# EAGLE design Jumper Board V3.0 (EAGLE 9.6.2)
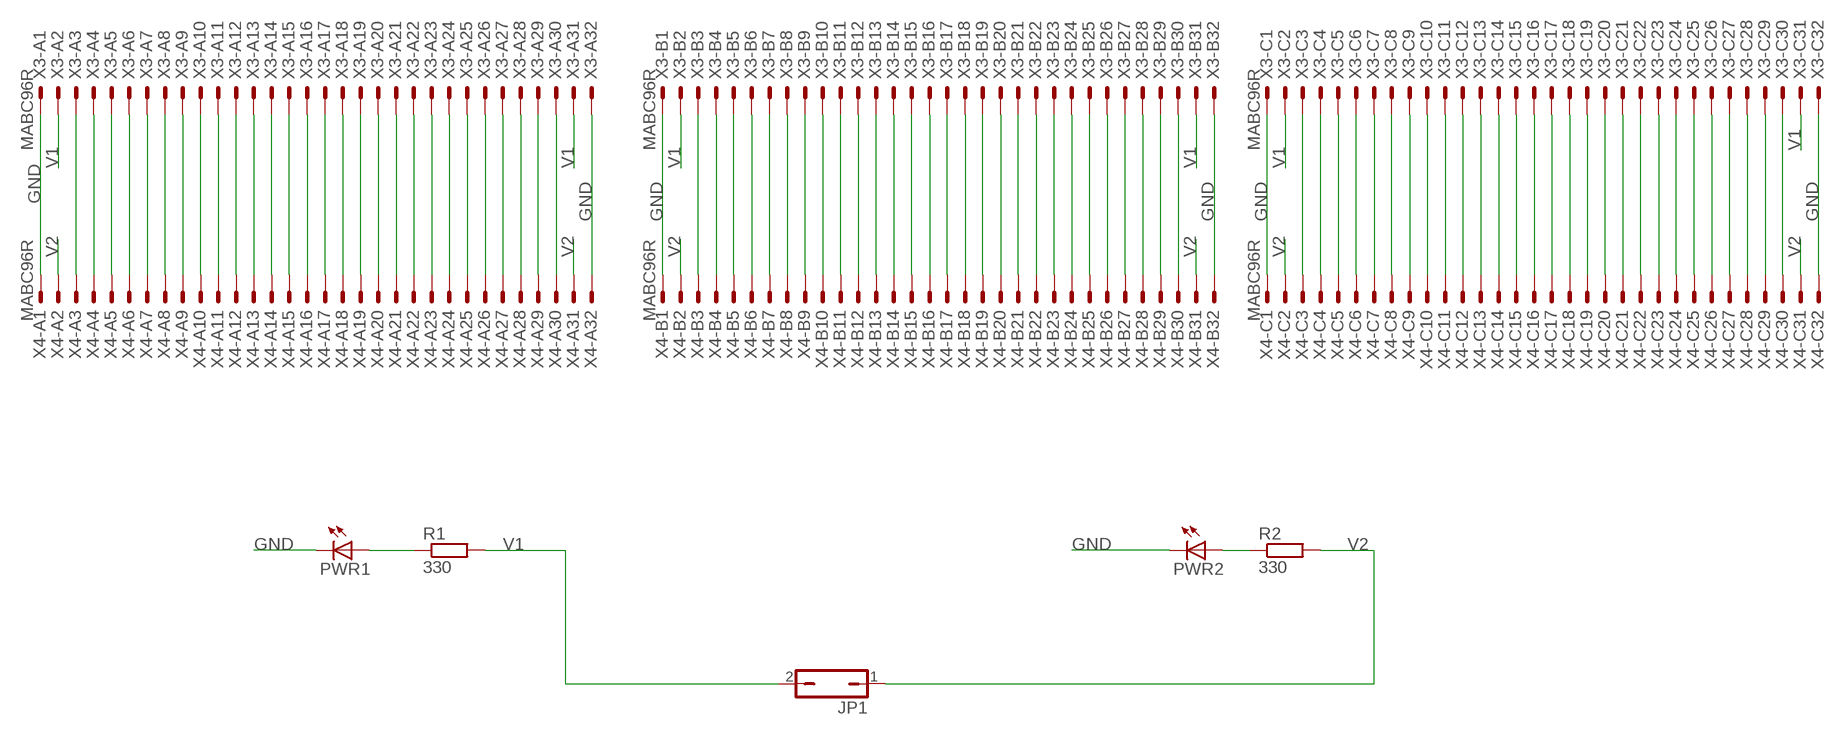
[diagram p0: schematic, sheet 1]

## Parts
JP1  JP1Q  [JP1]
PWR1  LED5MM  [LED5MM]
PWR2  LED5MM  [LED5MM]
R1  330  R0207/10  [0207/10]
R2  330  R0207/10  [0207/10]
X3  MABC96R  [MABC96R]
X4  MABC96R  [MABC96R]

## Nets
GND [GND]: PWR1.K(C) PWR2.K(C) X3.A1 X3.A32 X3.B1 X3.B32 X3.C1 X3.C32 X4.A1 X4.A32 X4.B1 X4.B32 X4.C1 X4.C32
N$4: X3.A3 X4.A3
N$6: X3.A4 X4.A4
N$7: X3.A5 X4.A5
N$8: X3.A6 X4.A6
N$9: X3.A7 X4.A7
N$10: X3.A8 X4.A8
N$11: X3.A9 X4.A9
N$12: X3.A10 X4.A10
N$13: X3.A11 X4.A11
N$14: X3.A12 X4.A12
N$15: X3.A13 X4.A13
N$16: X3.A14 X4.A14
N$17: X3.A15 X4.A15
N$18: X3.A16 X4.A16
N$19: X3.A17 X4.A17
N$20: X3.A18 X4.A18
N$21: X3.A19 X4.A19
N$22: X3.A20 X4.A20
N$23: X3.A21 X4.A21
N$24: X3.A22 X4.A22
N$25: X3.A23 X4.A23
N$26: X3.A24 X4.A24
N$27: X3.A25 X4.A25
N$28: X3.A26 X4.A26
N$29: X3.A27 X4.A27
N$30: X3.A28 X4.A28
N$31: X3.A29 X4.A29
N$32: X3.A30 X4.A30
N$35: PWR1.A R1.1
N$36: PWR2.A R2.1
N$37: X3.B3 X4.B3
N$38: X3.B4 X4.B4
N$39: X3.B5 X4.B5
N$40: X3.B6 X4.B6
N$41: X3.B7 X4.B7
N$42: X3.B8 X4.B8
N$43: X3.B9 X4.B9
N$44: X3.B10 X4.B10
N$45: X3.B11 X4.B11
N$46: X3.B12 X4.B12
N$47: X3.B13 X4.B13
N$48: X3.B14 X4.B14
N$49: X3.B15 X4.B15
N$50: X3.B16 X4.B16
N$51: X3.B17 X4.B17
N$52: X3.B18 X4.B18
N$53: X3.B19 X4.B19
N$54: X3.B20 X4.B20
N$55: X3.B21 X4.B21
N$56: X3.B22 X4.B22
N$57: X3.B23 X4.B23
N$58: X3.B24 X4.B24
N$59: X3.B25 X4.B25
N$60: X3.B26 X4.B26
N$61: X3.B27 X4.B27
N$62: X3.B28 X4.B28
N$63: X3.B29 X4.B29
N$64: X3.B30 X4.B30
N$69: X3.C3 X4.C3
N$70: X3.C4 X4.C4
N$71: X3.C5 X4.C5
N$72: X3.C6 X4.C6
N$73: X3.C7 X4.C7
N$74: X3.C8 X4.C8
N$75: X3.C9 X4.C9
N$76: X3.C10 X4.C10
N$77: X3.C11 X4.C11
N$78: X3.C12 X4.C12
N$79: X3.C13 X4.C13
N$80: X3.C14 X4.C14
N$81: X3.C15 X4.C15
N$82: X3.C16 X4.C16
N$83: X3.C17 X4.C17
N$84: X3.C18 X4.C18
N$85: X3.C19 X4.C19
N$86: X3.C20 X4.C20
N$87: X3.C21 X4.C21
N$88: X3.C22 X4.C22
N$89: X3.C23 X4.C23
N$90: X3.C24 X4.C24
N$91: X3.C25 X4.C25
N$92: X3.C26 X4.C26
N$93: X3.C27 X4.C27
N$94: X3.C28 X4.C28
N$95: X3.C29 X4.C29
N$96: X3.C30 X4.C30
V1 [VCC1]: JP1.2 R1.2 X3.A2 X3.A31 X3.B2 X3.B31 X3.C2 X3.C31
V2 [VCC2]: JP1.1 R2.2 X4.A2 X4.A31 X4.B2 X4.B31 X4.C2 X4.C31

## Library data of the parts
JP1 = jumper:JP1Q: JUMPER
PWR1 PWR2 = led:LED: LED OSRAM: - CHIPLED LG R971, LG N971, LY N971, LG Q971, LY Q971, LO R971, LY R971 LH N974, LH R974 LS Q976, LO Q976, LY Q976 LO Q996 - Hyper CHIPLED LW Q18S LB Q993, LB Q99A, LB R99A - SideLED LS A670, LO A670, LY A670, LG A670, LP A670 LB A673, LV A673, LT A673, LW A673 LH A674 LY A675 LS A676, LA A676, LO A676, LY A676, LW A676 LS A679, LY A679, LG A679 - Hyper Micro SIDELED® LS Y876, LA Y876, LO Y876, LY Y876 LT Y87S - SmartLED LW L88C, LW L88S LB L89C, LB L89S, LG L890 LS L89K, LO L89K, LY L89K LS L896, LA L896, LO L896, LY L896 - TOPLED LS T670, LO T670, LY T670, LG T670, LP T670 LSG T670, LSP T670, LSY T670, LOP T670, LYG T670 LG T671, LOG T671, LSG T671 LB T673, LV T673, LT T673, LW T673 LH T674 LS T676, LA T676, LO T676, LY T676, LB T676, LH T676, LSB T676, LW T676 LB T67C, LV T67C, LT T67C, LS T67K, LO T67K, LY T67K, LW E67C LS E67B, LA E67B, LO E67B, LY E67B, LB E67C, LV E67C, LT E67C LW T67C LS T679, LY T679, LG T679 LS T770, LO T770, LY T770, LG T770, LP T770 LB T773, LV T773, LT T773, LW T773 LH T774 LS E675, LA E675, LY E675, LS T675 LS T776, LA T776, LO T776, LY T776, LB T776 LHGB T686 LT T68C, LB T68C - Hyper Mini TOPLED® LB M676 - Mini TOPLED Santana® LG M470 LS M47K, LO M47K, LY M47K Source: http://www.osram.convergy.de LUXEON: - LUMILED® LXK2-PW12-R00, LXK2-PW12-S00, LXK2-PW14-U00, LXK2-PW14-V00 LXK2-PM12-R00, LXK2-PM12-S00, LXK2-PM14-U00 LXK2-PE12-Q00, LXK2-PE12-R00, LXK2-PE12-S00, LXK2-PE14-T00, LXK2-PE14-U00 LXK2-PB12-K00, LXK2-PB12-L00, LXK2-PB12-M00, LXK2-PB14-N00, LXK2-PB14-P00, LXK2-PB14-Q00 LXK2-PR12-L00, LXK2-PR12-M00, LXK2-PR14-Q00, LXK2-PR14-R00 LXK2-PD12-Q00, LXK2-PD12-R00, LXK2-PD12-S00 LXK2-PH12-R00, LXK2-PH12-S00 LXK2-PL12-P00, LXK2-PL12-Q00, LXK2-PL12-R00 Source: www.luxeon.com KINGBRIGHT: KA-3528ASYC Source: www.kingbright.com
R1 R2 = eagle-ltspice:R: RESISTOR, European symbol; SPICEMODEL: NONE; SPICEPREFIX: R
X3 X4 = con-vg:MABC96R: CONNECTOR male, 96 pins, type R, rows ABC, grid 2.54 mm

## Net classes
1 GND: width 0.508 mm, clearance 0.508 mm
2 VCC1: width 0.508 mm, clearance 0.508 mm
3 VCC2: width 0.508 mm, clearance 0.508 mm

## Board
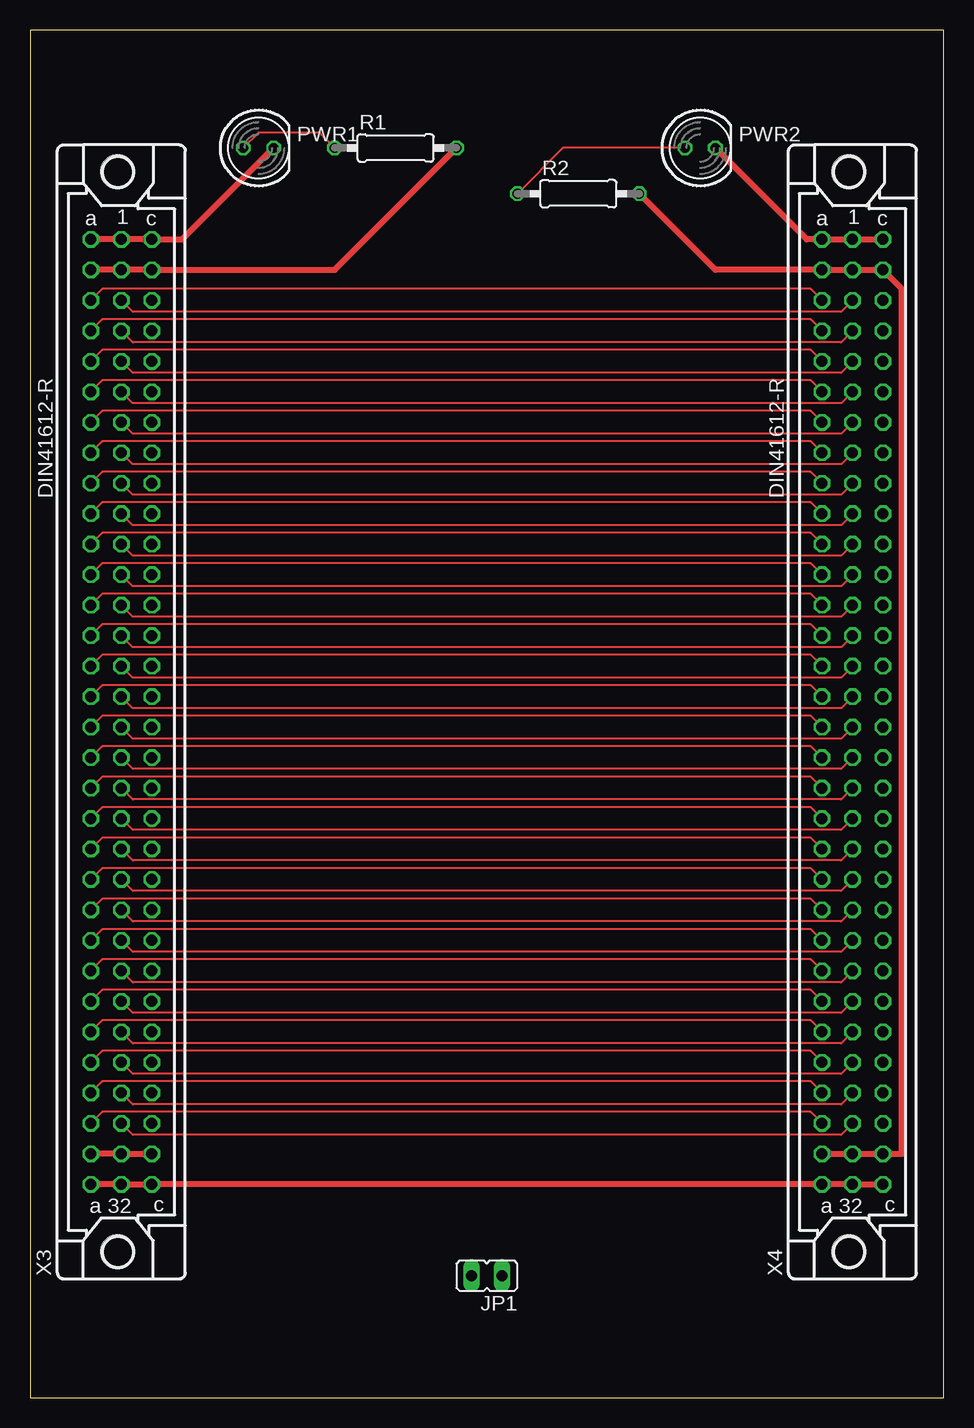
[diagram p1: board, top side]
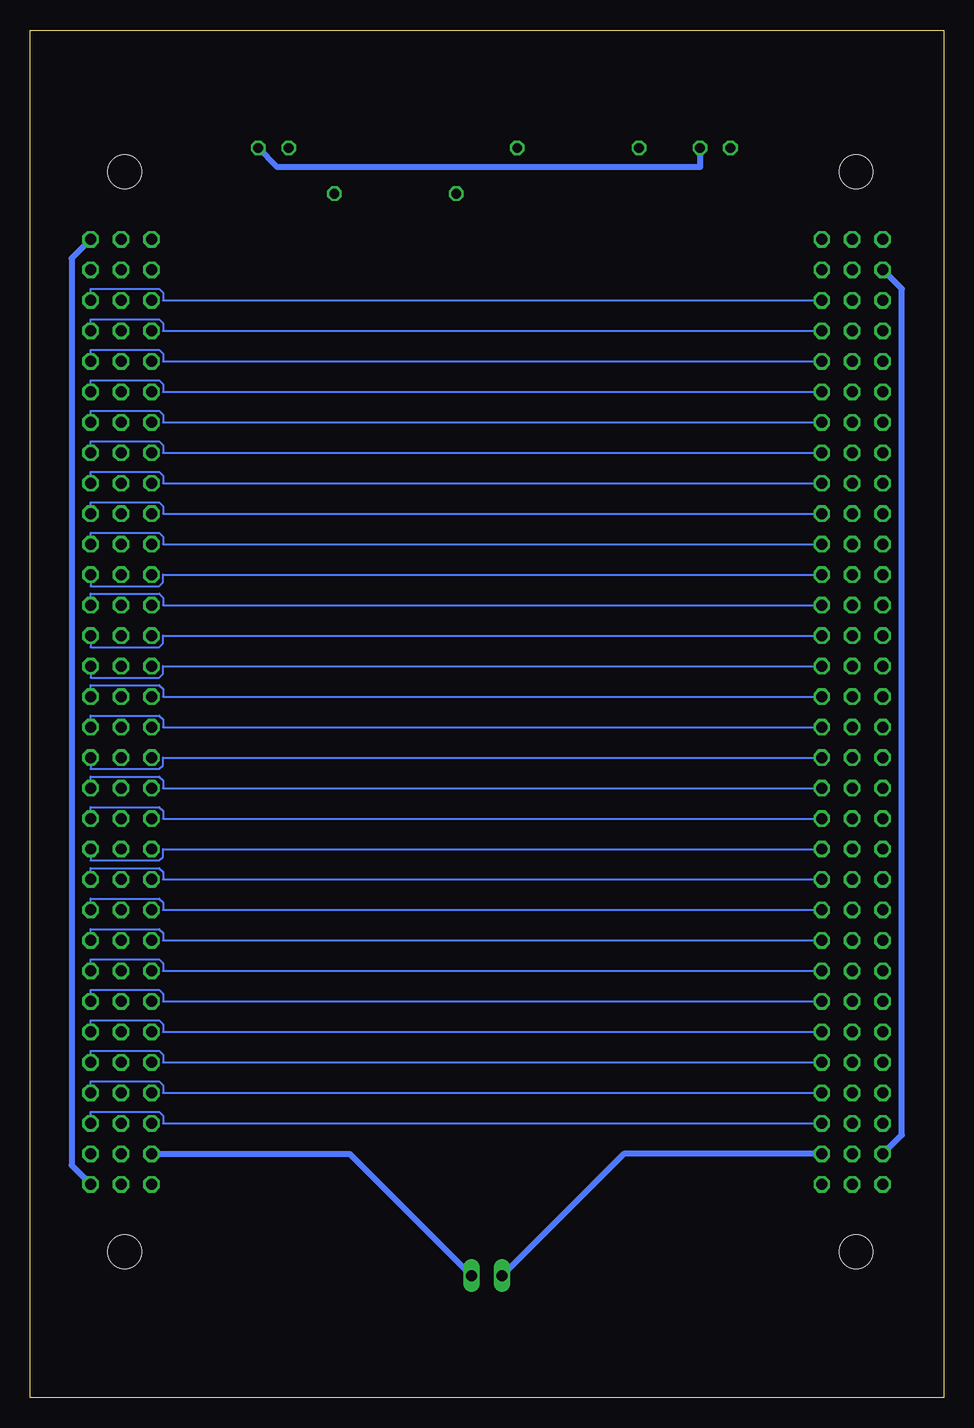
[diagram p2: board, bottom side, seen from below]

Size 76.18 x 113.97 mm. Coordinates in mm from the lower left corner, seen from the top.
Outline: 0,0 76.18,0 76.18,113.97 0,113.97 0,0
Copper layers (1*16): Top 0.0356mm / dielectric 1.5011mm / Bottom 0.0356mm
Design rules "LaenPCBOrder": minimum track width 6mil, minimum drill 13mil, track to track 6mil, track to pad 6mil, pad to pad 6mil, via to via 6mil, smd to smd 6mil, copper to edge 15mil, drill to drill 6mil, minimum pad ring 7mil, minimum via ring 7mil, stop-mask expansion 3mil, vias tented up to drill 0mil, thermal gap 10mil

### Footprints (pad centres in the part's own frame; a part is rotated, then mirrored left to right if it is on the bottom)
JP1 = drill 0.914 long: 1 0,-1.27; 2 0,1.27
LED5MM = drill 0.813 octagon: A -1.27,0; K 1.27,0
0207/10 = drill 0.813 octagon: 1 -5.08,0; 2 5.08,0
MABC96R = drill 0.914 octagon: A1 -2.54,39.37; A2 -2.54,36.83; A3 -2.54,34.29; A4 -2.54,31.75; A5 -2.54,29.21; A6 -2.54,26.67; A7 -2.54,24.13; A8 -2.54,21.59; A9 -2.54,19.05; A10 -2.54,16.51; A11 -2.54,13.97; A12 -2.54,11.43; A13 -2.54,8.89; A14 -2.54,6.35; A15 -2.54,3.81; A16 -2.54,1.27; A17 -2.54,-1.27; A18 -2.54,-3.81; A19 -2.54,-6.35; A20 -2.54,-8.89; A21 -2.54,-11.43; A22 -2.54,-13.97; A23 -2.54,-16.51; A24 -2.54,-19.05; A25 -2.54,-21.59; A26 -2.54,-24.13; A27 -2.54,-26.67; A28 -2.54,-29.21; A29 -2.54,-31.75; A30 -2.54,-34.29; A31 -2.54,-36.83; A32 -2.54,-39.37; B1 0,39.37; B2 0,36.83; B3 0,34.29; B4 0,31.75; B5 0,29.21; B6 0,26.67; B7 0,24.13; B8 0,21.59; B9 0,19.05; B10 0,16.51; B11 0,13.97; B12 0,11.43; B13 0,8.89; B14 0,6.35; B15 0,3.81; B16 0,1.27; B17 0,-1.27; B18 0,-3.81; B19 0,-6.35; B20 0,-8.89; B21 0,-11.43; B22 0,-13.97; B23 0,-16.51; B24 0,-19.05; B25 0,-21.59; B26 0,-24.13; B27 0,-26.67; B28 0,-29.21; B29 0,-31.75; B30 0,-34.29; B31 0,-36.83; B32 0,-39.37; C1 2.54,39.37; C2 2.54,36.83; C3 2.54,34.29; C4 2.54,31.75; C5 2.54,29.21; C6 2.54,26.67; C7 2.54,24.13; C8 2.54,21.59; C9 2.54,19.05; C10 2.54,16.51; C11 2.54,13.97; C12 2.54,11.43; C13 2.54,8.89; C14 2.54,6.35; C15 2.54,3.81; C16 2.54,1.27; C17 2.54,-1.27; C18 2.54,-3.81; C19 2.54,-6.35; C20 2.54,-8.89; C21 2.54,-11.43; C22 2.54,-13.97; C23 2.54,-16.51; C24 2.54,-19.05; C25 2.54,-21.59; C26 2.54,-24.13; C27 2.54,-26.67; C28 2.54,-29.21; C29 2.54,-31.75; C30 2.54,-34.29; C31 2.54,-36.83; C32 2.54,-39.37 | hole 2.794: -0.305,45; -0.305,-45

### Placement (x,y rotation side)
JP1  38.1,10.16 90 top
PWR1  19.05,104.14 0 top
PWR2  55.88,104.14 0 top
R1  30.48,104.14 0 top
R2  45.72,100.33 0 top
X3  7.62,57.15 0 top
X4  68.58,57.15 0 top

### Tracks (layer width: path | path; a pad name or v marks a point on that pad's centre or on a via)
GND
  Top 0.508: X3.A32 X3.B32 X3.C32 X4.A32 X4.B32 X4.C32 | PWR2.K 64.77,96.52 X4.A1 X4.B1 X4.C1 | X3.A1 X3.B1 X3.C1 12.7,96.52 PWR1.K
  Bottom 0.508: PWR2.K 55.56,102.55 20.32,102.55 PWR1.K | X4.C32 72.71,19.37 72.71,94.93 X4.C1
N$4
  Top 0.152: X3.A3 6.03,92.39 65.09,92.39 X4.A3
N$6
  Top 0.152: X3.A4 6.03,89.85 65.09,89.85 X4.A4
N$7
  Top 0.152: X3.A5 6.03,87.31 65.09,87.31 X4.A5
N$8
  Top 0.152: X3.A6 6.03,84.77 65.09,84.77 X4.A6
N$9
  Top 0.152: X3.A7 6.03,82.23 65.09,82.23 X4.A7
N$10
  Top 0.152: X3.A8 6.03,79.69 65.09,79.69 X4.A8
N$11
  Top 0.152: X3.A9 6.03,77.15 65.09,77.15 X4.A9
N$12
  Top 0.152: X3.A10 6.03,74.61 65.09,74.61 X4.A10
N$13
  Top 0.152: X3.A11 6.03,72.07 65.09,72.07 X4.A11
N$14
  Top 0.152: X3.A12 6.03,69.53 65.09,69.53 X4.A12
N$15
  Top 0.152: X3.A13 6.03,66.99 65.09,66.99 X4.A13
N$16
  Top 0.152: X3.A14 6.03,64.45 65.09,64.45 X4.A14
N$17
  Top 0.152: X3.A15 6.03,61.91 65.09,61.91 X4.A15
N$18
  Top 0.152: X3.A16 6.03,59.37 65.09,59.37 X4.A16
N$19
  Top 0.152: X3.A17 6.03,56.83 65.09,56.83 X4.A17
N$20
  Top 0.152: X3.A18 6.03,54.29 65.09,54.29 X4.A18
N$21
  Top 0.152: X3.A19 6.03,51.75 65.09,51.75 X4.A19
N$22
  Top 0.152: X3.A20 6.03,49.21 65.09,49.21 X4.A20
N$23
  Top 0.152: X3.A21 6.03,46.67 65.09,46.67 X4.A21
N$24
  Top 0.152: X3.A22 6.03,44.13 65.09,44.13 X4.A22
N$25
  Top 0.152: X3.A23 6.03,41.59 65.09,41.59 X4.A23
N$26
  Top 0.152: X3.A24 6.03,39.05 65.09,39.05 X4.A24
N$27
  Top 0.152: X3.A25 6.03,36.51 65.09,36.51 X4.A25
N$28
  Top 0.152: X3.A26 6.03,33.97 65.09,33.97 X4.A26
N$29
  Top 0.152: X3.A27 6.03,31.43 65.09,31.43 X4.A27
N$30
  Top 0.152: X3.A28 6.03,28.89 65.09,28.89 X4.A28
N$31
  Top 0.152: X3.A29 6.03,26.35 65.09,26.35 X4.A29
N$32
  Top 0.152: X3.A30 6.03,23.81 65.09,23.81 X4.A30
N$35
  Top 0.152: PWR1.A 19.05,105.41 24.13,105.41 R1.1
N$36
  Top 0.152: R2.1 44.45,104.14 PWR2.A
N$37
  Top 0.152: X3.B3 8.57,90.49 67.63,90.49 X4.B3
N$38
  Top 0.152: X3.B4 8.57,87.95 67.63,87.95 X4.B4
N$39
  Top 0.152: X3.B5 8.57,85.41 67.63,85.41 X4.B5
N$40
  Top 0.152: X3.B6 8.57,82.87 67.63,82.87 X4.B6
N$41
  Top 0.152: X3.B7 8.57,80.33 67.63,80.33 X4.B7
N$42
  Top 0.152: X3.B8 8.57,77.79 67.63,77.79 X4.B8
N$43
  Top 0.152: X3.B9 8.57,75.25 67.63,75.25 X4.B9
N$44
  Top 0.152: X3.B10 8.57,72.71 67.63,72.71 X4.B10
N$45
  Top 0.152: X3.B11 8.57,70.17 67.63,70.17 X4.B11
N$46
  Top 0.152: X3.B12 8.57,67.63 67.63,67.63 X4.B12
N$47
  Top 0.152: X3.B13 8.57,65.09 67.63,65.09 X4.B13
N$48
  Top 0.152: X3.B14 8.57,62.55 67.63,62.55 X4.B14
N$49
  Top 0.152: X3.B15 8.57,60.01 67.63,60.01 X4.B15
N$50
  Top 0.152: X3.B16 8.57,57.47 67.63,57.47 X4.B16
N$51
  Top 0.152: X3.B17 8.57,54.93 67.63,54.93 X4.B17
N$52
  Top 0.152: X3.B18 8.57,52.39 67.63,52.39 X4.B18
N$53
  Top 0.152: X3.B19 8.57,49.85 67.63,49.85 X4.B19
N$54
  Top 0.152: X3.B20 8.57,47.31 67.63,47.31 X4.B20
N$55
  Top 0.152: X3.B21 8.57,44.77 67.63,44.77 X4.B21
N$56
  Top 0.152: X3.B22 8.57,42.23 67.63,42.23 X4.B22
N$57
  Top 0.152: X3.B23 8.57,39.69 67.63,39.69 X4.B23
N$58
  Top 0.152: X3.B24 8.57,37.15 67.63,37.15 X4.B24
N$59
  Top 0.152: X3.B25 8.57,34.61 67.63,34.61 X4.B25
N$60
  Top 0.152: X3.B26 8.57,32.07 67.63,32.07 X4.B26
N$61
  Top 0.152: X3.B27 8.57,29.53 67.63,29.53 X4.B27
N$62
  Top 0.152: X3.B28 8.57,26.99 67.63,26.99 X4.B28
N$63
  Top 0.152: X3.B29 8.57,24.45 67.63,24.45 X4.B29
N$64
  Top 0.152: X3.B30 8.57,21.91 67.63,21.91 X4.B30
N$69
  Bottom 0.152: X3.C3 65.09,91.44 65.09,92.08 65.41,92.39 71.12,92.39 X4.C3
N$70
  Bottom 0.152: X3.C4 65.09,88.9 65.09,89.53 65.41,89.85 71.12,89.85 X4.C4
N$71
  Bottom 0.152: X3.C5 65.09,86.36 65.09,87 65.41,87.31 71.12,87.31 X4.C5
N$72
  Bottom 0.152: X3.C6 65.09,83.82 65.09,84.45 65.41,84.77 71.12,84.77 X4.C6
N$73
  Bottom 0.152: X3.C7 65.09,81.28 65.09,81.92 65.41,82.23 71.12,82.23 X4.C7
N$74
  Bottom 0.152: X3.C8 65.09,78.74 65.09,79.38 65.41,79.69 71.12,79.69 X4.C8
N$75
  Bottom 0.152: X3.C9 65.09,76.2 65.09,76.83 65.41,77.15 71.12,77.15 X4.C9
N$76
  Bottom 0.152: X3.C10 65.09,73.66 65.09,74.3 65.41,74.61 71.12,74.61 X4.C10
N$77
  Bottom 0.152: X3.C11 65.09,71.12 65.09,71.75 65.41,72.07 71.12,72.07 X4.C11
N$78
  Bottom 0.152: X3.C12 65.09,68.58 65.09,67.94 65.41,67.63 71.12,67.63 X4.C12
N$79
  Bottom 0.152: X3.C13 65.09,66.04 65.09,66.67 65.41,66.99 71.12,66.99 X4.C13
N$80
  Bottom 0.152: X3.C14 65.09,63.5 65.09,62.87 65.41,62.55 71.12,62.55 X4.C14
N$81
  Bottom 0.152: X3.C15 65.09,60.96 65.09,60.33 65.41,60.01 71.12,60.01 X4.C15
N$82
  Bottom 0.152: X3.C16 65.09,58.42 65.09,59.05 65.41,59.37 71.12,59.37 X4.C16
N$83
  Bottom 0.152: X3.C17 65.09,55.88 65.09,56.52 65.41,56.83 71.12,56.83 X4.C17
N$84
  Bottom 0.152: X3.C18 65.09,53.34 65.09,52.7 65.41,52.39 71.12,52.39 X4.C18
N$85
  Bottom 0.152: X3.C19 65.09,50.8 65.09,51.44 65.41,51.75 71.12,51.75 X4.C19
N$86
  Bottom 0.152: X3.C20 65.09,48.26 65.09,48.9 65.41,49.21 71.12,49.21 X4.C20
N$87
  Bottom 0.152: X3.C21 65.09,45.72 65.09,45.09 65.41,44.77 71.12,44.77 X4.C21
N$88
  Bottom 0.152: X3.C22 65.09,43.18 65.09,43.81 65.41,44.13 71.12,44.13 X4.C22
N$89
  Bottom 0.152: X3.C23 65.09,40.64 65.09,41.27 65.41,41.59 71.12,41.59 X4.C23
N$90
  Bottom 0.152: X3.C24 65.09,38.1 65.09,38.73 65.41,39.05 71.12,39.05 X4.C24
N$91
  Bottom 0.152: X3.C25 65.09,35.56 65.09,36.2 65.41,36.51 71.12,36.51 X4.C25
N$92
  Bottom 0.152: X3.C26 65.09,33.02 65.09,33.66 65.41,33.97 71.12,33.97 X4.C26
N$93
  Bottom 0.152: X3.C27 65.09,30.48 65.09,31.11 65.41,31.43 71.12,31.43 X4.C27
N$94
  Bottom 0.152: X3.C28 65.09,27.94 65.09,28.57 65.41,28.89 71.12,28.89 X4.C28
N$95
  Bottom 0.152: X3.C29 65.09,25.4 65.09,26.04 65.41,26.35 71.12,26.35 X4.C29
N$96
  Bottom 0.152: X3.C30 65.09,22.86 65.09,23.5 65.41,23.81 71.12,23.81 X4.C30
V1
  Top 0.508: X3.A2 X3.B2 X3.C2 25.4,93.98 R1.2 | X3.A31 X3.B31 X3.C31
  Bottom 0.508: JP1.2 26.67,20.32 X3.C31 | X3.A2 3.49,92.39 3.49,21.91 X3.A31
V2
  Top 0.508: R2.2 57.15,93.98 X4.A2 X4.B2 X4.C2 72.71,92.39 72.71,20.32 X4.C31 X4.B31 X4.A31
  Bottom 0.508: JP1.1 49.53,20.32 X4.A31

### Text on the board
tValues: YACC1 BUS JUMPER BOARD V3.0 | onepagecomputer.com